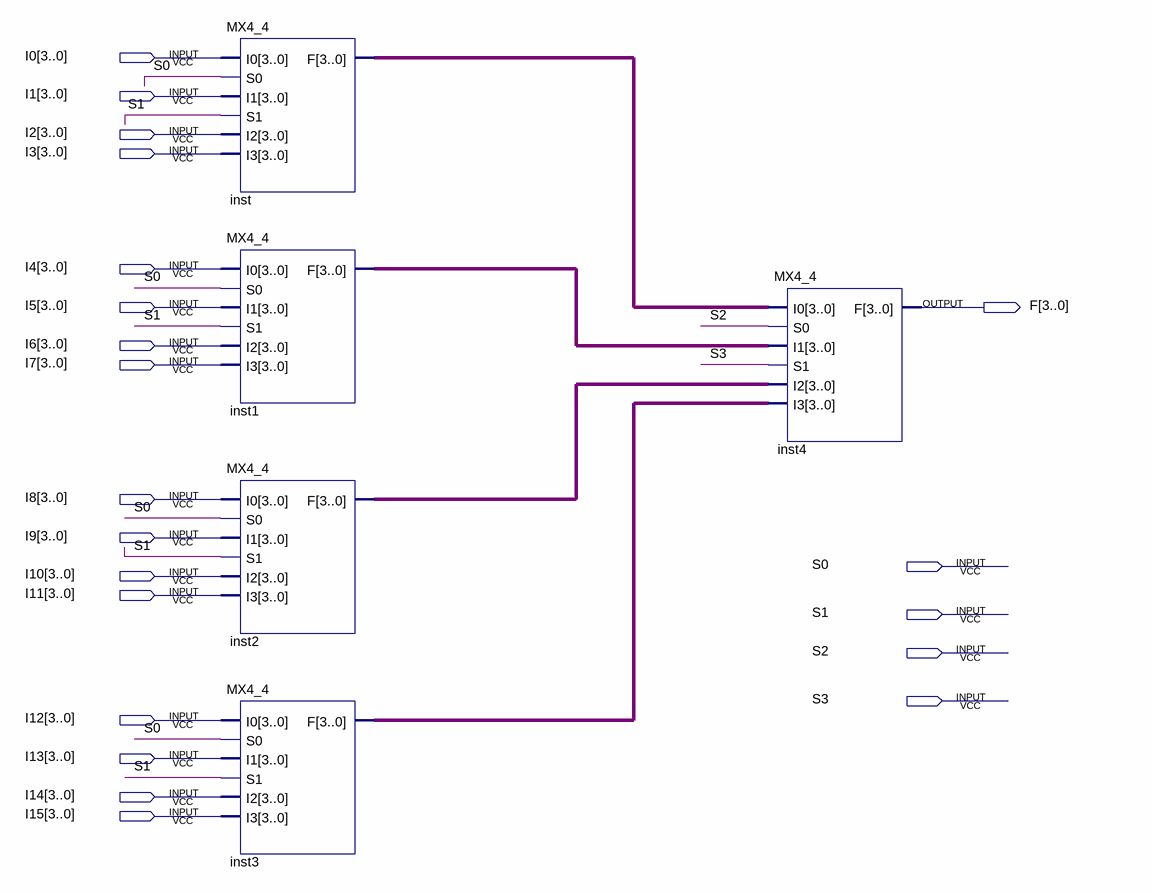
[diagram p0: schematic sheet]
// Quartus schematic MX4_16.bdf as structural Verilog: 5 symbols, 21 pins
module MX4_16 (
  input  [3:0] I0,
  input  [3:0] I1,
  input  [3:0] I2,
  input  [3:0] I3,
  input  [3:0] I4,
  input  [3:0] I5,
  input  [3:0] I6,
  input  [3:0] I7,
  input  [3:0] I8,
  input  [3:0] I9,
  input  S0,
  input  [3:0] I10,
  input  [3:0] I11,
  input  S1,
  input  S2,
  input  S3,
  input  [3:0] I12,
  input  [3:0] I13,
  input  [3:0] I14,
  input  [3:0] I15,
  output [3:0] F
);

  wire [3:0] inst1_f, inst2_f, inst3_f, inst_f;

  MX4_4 inst (.I0(I0), .S0(S0), .I1(I1), .S1(S1), .I2(I2), .I3(I3), .F(inst_f));
  MX4_4 inst1 (.I0(I4), .S0(S0), .I1(I5), .S1(S1), .I2(I6), .I3(I7), .F(inst1_f));
  MX4_4 inst2 (.I0(I8), .S0(S0), .I1(I9), .S1(S1), .I2(I10), .I3(I11), .F(inst2_f));
  MX4_4 inst3 (.I0(I12), .S0(S0), .I1(I13), .S1(S1), .I2(I14), .I3(I15), .F(inst3_f));
  MX4_4 inst4 (.I0(inst_f), .S0(S2), .I1(inst1_f), .S1(S3), .I2(inst2_f), .I3(inst3_f), .F(F));
endmodule
